# Altium schematic sheet CR-10 Motherboard_2.SchDoc: Sheet Description
size A3; Organization: Organization; Address1: Address1; Address2: Address2; Address3: Address3; Address4: Address4; DocumentNumber: 2; Revision: 0; SheetNumber: 2; SheetTotal: 2; PageSetup: Record=PageOptions|CenterHorizontal=True|CenterVertical=True|PrintScale=1.00|XCorrection=1.00|YCorrection=1.00|PrintKind=1|BorderSize=5000000|LeftOffset=0|BottomOffset=0|Orientation=2|PaperLength=1000|PaperWidth=1000|Scale=100|PaperSource=7|PrintQuality=-4|MediaType=1|DitherType=10|PaperKind=A3|PrintScaleMode=0
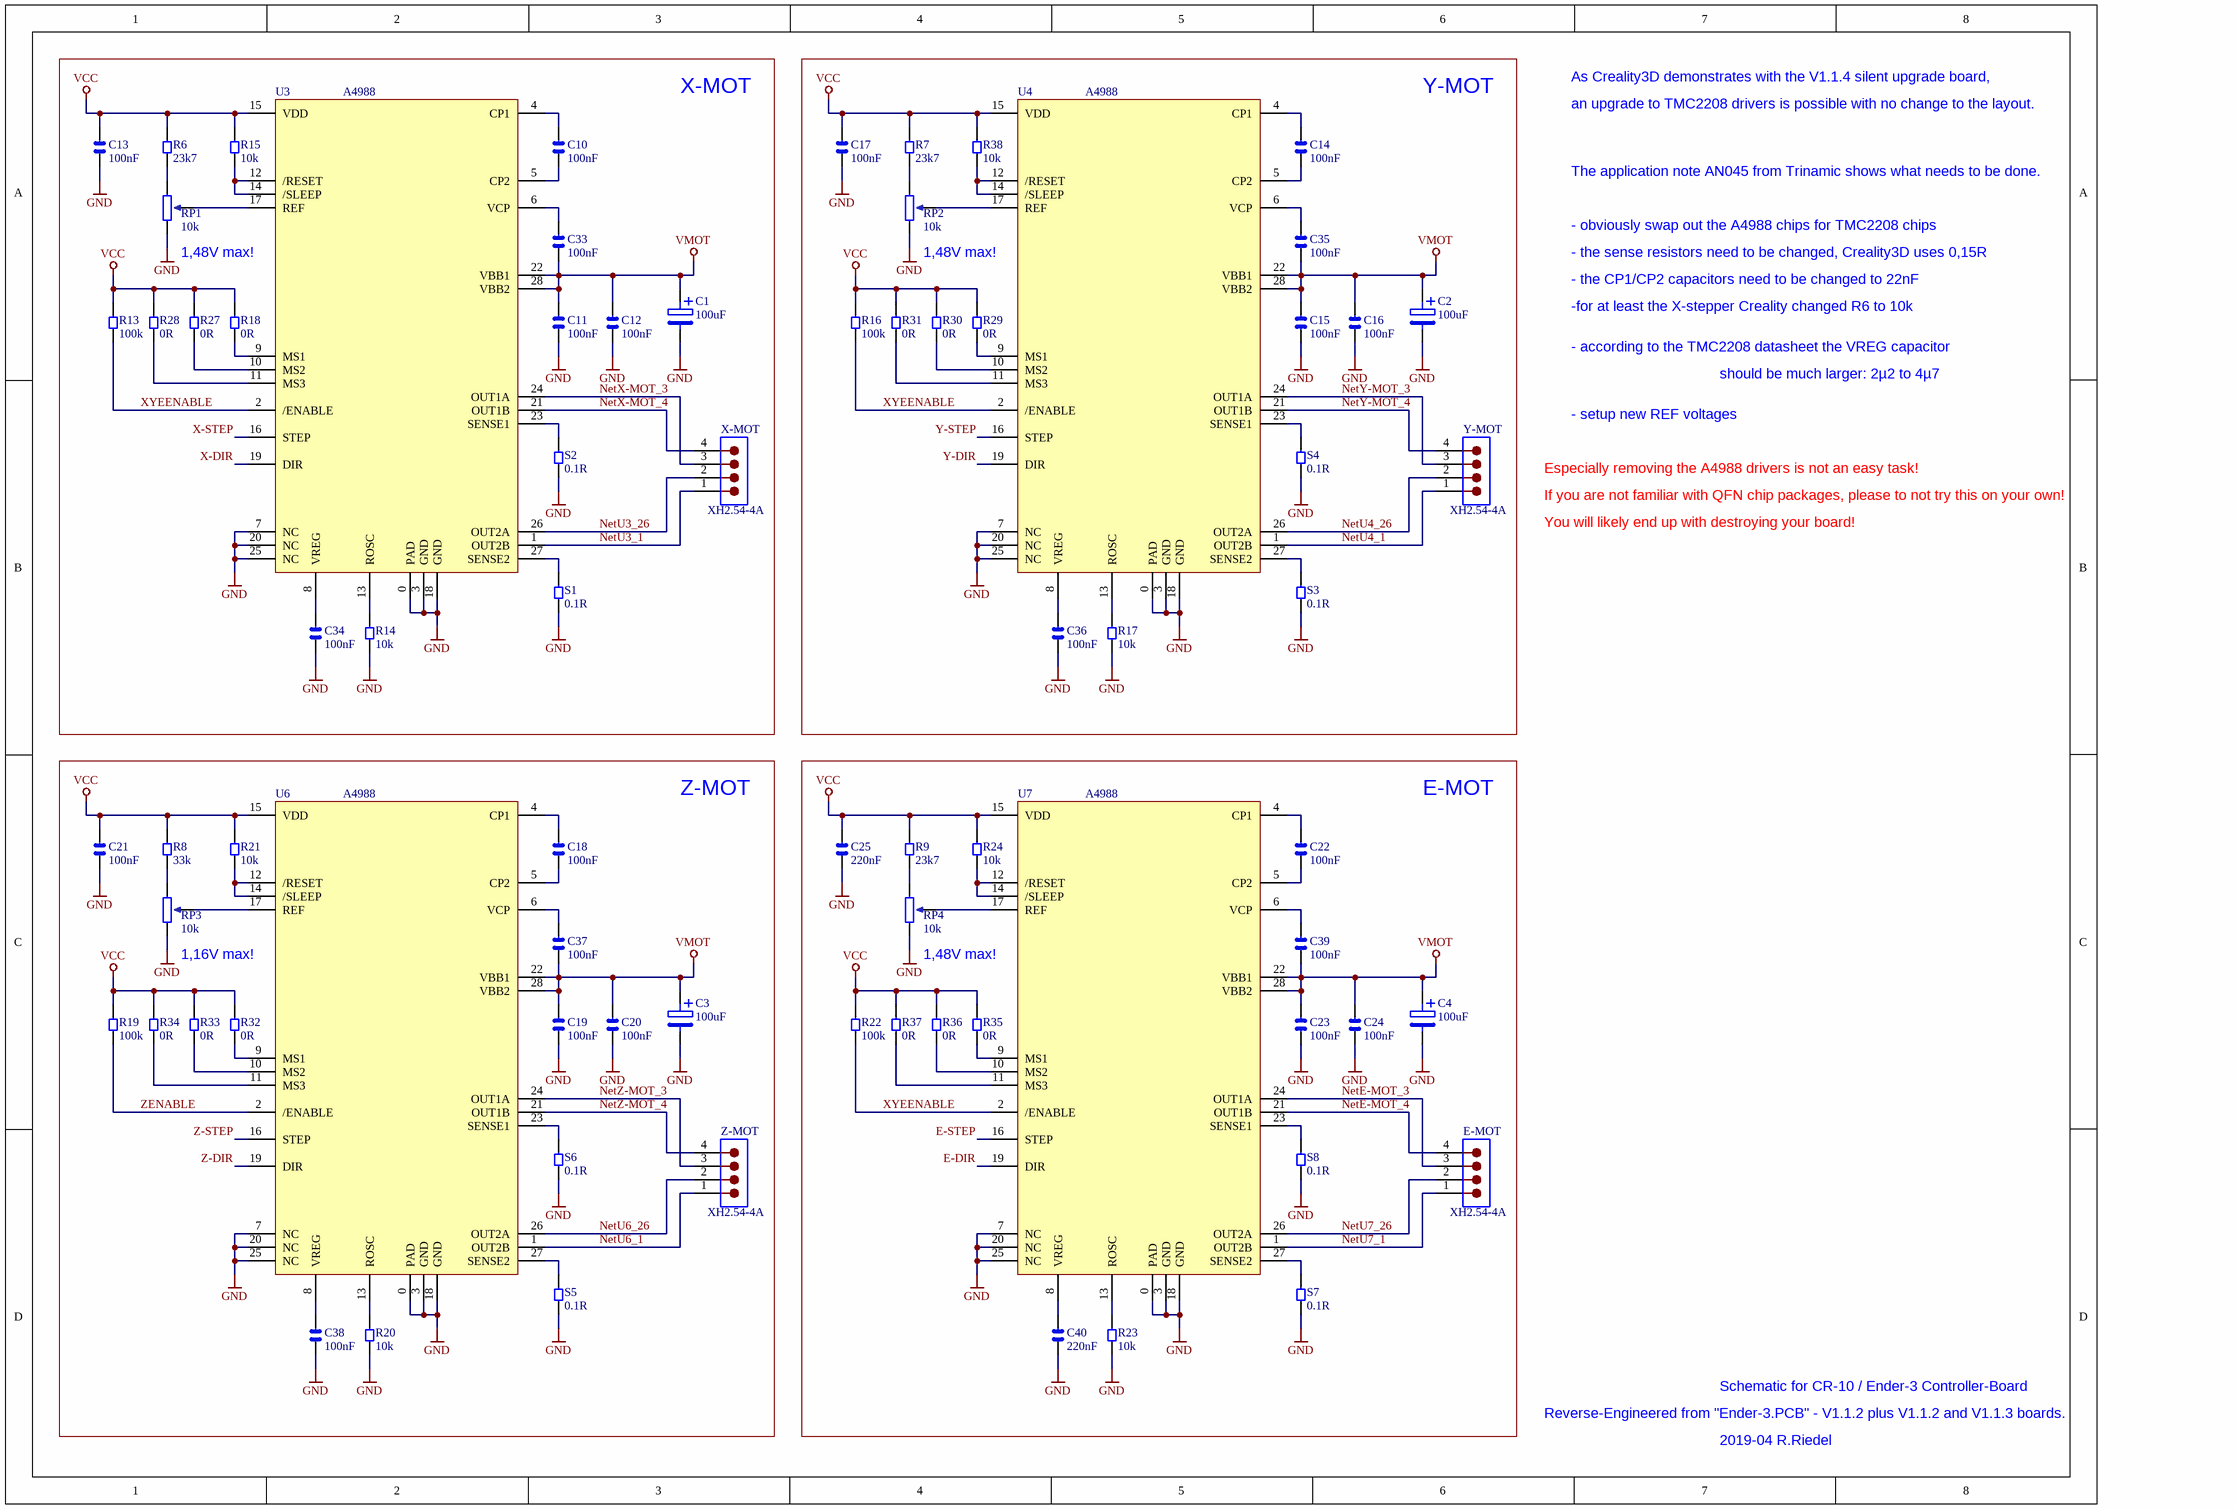
[diagram p0: CR-10 Motherboard_2.SchDoc]

## Parts
C1  100uF  [CAP-100]
C2  100uF  [CAP-100]
C3  100uF  [CAP-100]
C4  100uF  [CAP-100]
C10  100nF  [0603]
C11  100nF  [0603]
C12  100nF  [0603]
C13  100nF  [0603]
C14  100nF  [0603]
C15  100nF  [0603]
C16  100nF  [0603]
C17  100nF  [0603]
C18  100nF  [0603]
C19  100nF  [0603]
C20  100nF  [0603]
C21  100nF  [0603]
C22  100nF  [0603]
C23  100nF  [0603]
C24  100nF  [0603]
C25  220nF  [0603]
C33  100nF  [0603]
C34  100nF  [0603]
C35  100nF  [0603]
C36  100nF  [0603]
C37  100nF  [0603]
C38  100nF  [0603]
C39  100nF  [0603]
C40  220nF  [0603]
E-MOT  XH2.54-4A  [P4]
R6  23k7  [0603]
R7  23k7  [0603]
R8  33k  [0603]
R9  23k7  [0603]
R13  100k  [0603]
R14  10k  [0603]
R15  10k  [0603]
R16  100k  [0603]
R17  10k  [0603]
R18  0R  [0603]
R19  100k  [0603]
R20  10k  [0603]
R21  10k  [0603]
R22  100k  [0603]
R23  10k  [0603]
R24  10k  [0603]
R27  0R  [0603]
R28  0R  [0603]
R29  0R  [0603]
R30  0R  [0603]
R31  0R  [0603]
R32  0R  [0603]
R33  0R  [0603]
R34  0R  [0603]
R35  0R  [0603]
R36  0R  [0603]
R37  0R  [0603]
R38  10k  [0603]
RP1  10k  [RP]
RP2  10k  [RP]
RP3  10k  [RP]
RP4  10k  [RP]
S1  0.1R  [R100]
S2  0.1R  [R100]
S3  0.1R  [R100]
S4  0.1R  [R100]
S5  0.1R  [R100]
S6  0.1R  [R100]
S7  0.1R  [R100]
S8  0.1R  [R100]
U3  A4988  [QFP28]
U4  A4988  [QFP28]
U6  A4988  [QFP28]
U7  A4988  [QFP28]
X-MOT  XH2.54-4A  [P4]
Y-MOT  XH2.54-4A  [P4]
Z-MOT  XH2.54-4A  [P4]

## Blocks framed on the sheet
X-MOT: C1 C10-C13 C33 C34 R6 R13-R15 R18 R27 R28 RP1 S1 S2 U3 X-MOT
Y-MOT: C2 C14-C17 C35 C36 R7 R16 R17 R29-R31 R38 RP2 S3 S4 U4 Y-MOT
Z-MOT: C3 C18-C21 C37 C38 R8 R19-R21 R32-R34 RP3 S5 S6 U6 Z-MOT
E-MOT: C4 C22-C25 C39 C40 E-MOT R9 R22-R24 R35-R37 RP4 S7 S8 U7

## Nets
GND: C1.2 C2.2 C3.2 C4.2 C11.1 C12.2 C13.2 C15.1 C16.2 C17.2 C19.1 C20.2 C21.2 C23.1 C24.2 C25.2 C34.2 C36.2 C38.2 C40.2 R14.2 R17.2 R20.2 R23.2 RP1.2 RP2.2 RP3.2 RP4.2 S1.2 S2.2 S3.2 S4.2 S5.2 S6.2 S7.2 S8.2 U3.0(PAD) U3.3(GND) U3.7(NC) U3.18(GND) U3.20(NC) U3.25(NC) U4.0(PAD) U4.3(GND) U4.7(NC) U4.18(GND) U4.20(NC) U4.25(NC) U6.0(PAD) U6.3(GND) U6.7(NC) U6.18(GND) U6.20(NC) U6.25(NC) U7.0(PAD) U7.3(GND) U7.7(NC) U7.18(GND) U7.20(NC) U7.25(NC)
VCC: C13.1 C17.1 C21.1 C25.1 R6.2 R7.2 R8.2 R9.2 R13.2 R15.2 R16.2 R18.2 R19.2 R21.2 R22.2 R24.2 R27.2 R28.2 R29.2 R30.2 R31.2 R32.2 R33.2 R34.2 R35.2 R36.2 R37.2 R38.2 U3.15(VDD) U4.15(VDD) U6.15(VDD) U7.15(VDD)
VMOT: C1.1 C2.1 C3.1 C4.1 C11.2 C12.1 C15.2 C16.1 C19.2 C20.1 C23.2 C24.1 C33.2 C35.2 C37.2 C39.2 U3.22(VBB1) U3.28(VBB2) U4.22(VBB1) U4.28(VBB2) U6.22(VBB1) U6.28(VBB2) U7.22(VBB1) U7.28(VBB2)
E-DIR: U7.19(DIR)
E-STEP: U7.16(STEP)
NetE-MOT_3: E-MOT.3 U7.24(OUT1A)
NetE-MOT_4: E-MOT.4 U7.21(OUT1B)
NetU3_1: U3.1(OUT2B) X-MOT.1
NetU3_26: U3.26(OUT2A) X-MOT.2
NetU4_1: U4.1(OUT2B) Y-MOT.1
NetU4_26: U4.26(OUT2A) Y-MOT.2
NetU6_1: U6.1(OUT2B) Z-MOT.1
NetU6_26: U6.26(OUT2A) Z-MOT.2
NetU7_1: E-MOT.1 U7.1(OUT2B)
NetU7_26: E-MOT.2 U7.26(OUT2A)
NetX-MOT_3: U3.24(OUT1A) X-MOT.3
NetX-MOT_4: U3.21(OUT1B) X-MOT.4
NetY-MOT_3: U4.24(OUT1A) Y-MOT.3
NetY-MOT_4: U4.21(OUT1B) Y-MOT.4
NetZ-MOT_3: U6.24(OUT1A) Z-MOT.3
NetZ-MOT_4: U6.21(OUT1B) Z-MOT.4
X-DIR: U3.19(DIR)
X-STEP: U3.16(STEP)
XYEENABLE: R13.1 R16.1 R22.1 U3.2(/ENABLE) U4.2(/ENABLE) U7.2(/ENABLE)
Y-DIR: U4.19(DIR)
Y-STEP: U4.16(STEP)
Z-DIR: U6.19(DIR)
Z-STEP: U6.16(STEP)
ZENABLE: R19.1 U6.2(/ENABLE)
NetC10_1: C10.1 U3.4(CP1)
NetC10_2: C10.2 U3.5(CP2)
NetC14_1: C14.1 U4.4(CP1)
NetC14_2: C14.2 U4.5(CP2)
NetC18_1: C18.1 U6.4(CP1)
NetC18_2: C18.2 U6.5(CP2)
NetC22_1: C22.1 U7.4(CP1)
NetC22_2: C22.2 U7.5(CP2)
NetC33_1: C33.1 U3.6(VCP)
NetC34_1: C34.1 U3.8(VREG)
NetC35_1: C35.1 U4.6(VCP)
NetC36_1: C36.1 U4.8(VREG)
NetC37_1: C37.1 U6.6(VCP)
NetC38_1: C38.1 U6.8(VREG)
NetC39_1: C39.1 U7.6(VCP)
NetC40_1: C40.1 U7.8(VREG)
NetR6_1: R6.1 RP1.3
NetR7_1: R7.1 RP2.3
NetR8_1: R8.1 RP3.3
NetR9_1: R9.1 RP4.3
NetR14_1: R14.1 U3.13(ROSC)
NetR15_1: R15.1 U3.12(/RESET) U3.14(/SLEEP)
NetR17_1: R17.1 U4.13(ROSC)
NetR18_1: R18.1 U3.9(MS1)
NetR20_1: R20.1 U6.13(ROSC)
NetR21_1: R21.1 U6.12(/RESET) U6.14(/SLEEP)
NetR23_1: R23.1 U7.13(ROSC)
NetR24_1: R24.1 U7.12(/RESET) U7.14(/SLEEP)
NetR27_1: R27.1 U3.10(MS2)
NetR28_1: R28.1 U3.11(MS3)
NetR29_1: R29.1 U4.9(MS1)
NetR30_1: R30.1 U4.10(MS2)
NetR31_1: R31.1 U4.11(MS3)
NetR32_1: R32.1 U6.9(MS1)
NetR33_1: R33.1 U6.10(MS2)
NetR34_1: R34.1 U6.11(MS3)
NetR35_1: R35.1 U7.9(MS1)
NetR36_1: R36.1 U7.10(MS2)
NetR37_1: R37.1 U7.11(MS3)
NetR38_1: R38.1 U4.12(/RESET) U4.14(/SLEEP)
NetRP1_1: RP1.1 U3.17(REF)
NetRP2_1: RP2.1 U4.17(REF)
NetRP3_1: RP3.1 U6.17(REF)
NetRP4_1: RP4.1 U7.17(REF)
NetS1_1: S1.1 U3.27(SENSE2)
NetS2_1: S2.1 U3.23(SENSE1)
NetS3_1: S3.1 U4.27(SENSE2)
NetS4_1: S4.1 U4.23(SENSE1)
NetS5_1: S5.1 U6.27(SENSE2)
NetS6_1: S6.1 U6.23(SENSE1)
NetS7_1: S7.1 U7.27(SENSE2)
NetS8_1: S8.1 U7.23(SENSE1)

## Notes on the sheet
- As Creality3D demonstrates with the V1.1.4 silent upgrade board,
- an upgrade to TMC2208 drivers is possible with no change to the layout.
- The application note AN045 from Trinamic shows what needs to be done.
- - obviously swap out the A4988 chips for TMC2208 chips
- 1,48V max!
- - the sense resistors need to be changed, Creality3D uses 0,15R
- - the CP1/CP2 capacitors need to be changed to 22nF
- -for at least the X-stepper Creality changed R6 to 10k
- - according to the TMC2208 datasheet the VREG capacitor
- should be much larger: 2µ2 to 4µ7
- - setup new REF voltages
- Especially removing the A4988 drivers is not an easy task!
- If you are not familiar with QFN chip packages, please to not try this on your own!
- You will likely end up with destroying your board!
- 1,16V max!
- Schematic for CR-10 / Ender-3 Controller-Board
- Reverse-Engineered from "Ender-3.PCB" - V1.1.2 plus V1.1.2 and V1.1.3 boards.
- 2019-04 R.Riedel

## Library data of the parts
C1-C4 = Capacitor Pol: Capacitor Polarized
C10-C25 C33-C40 = Capacitor: Chip Capacitor
E-MOT X-MOT Y-MOT Z-MOT = Header 1x4
R6-R9 R13-R24 R27-R38 S1-S8 = Resistor: Chip Resistor
RP1-RP4 = RTrimm